# Altium schematic sheet ch347f.SchDoc
size A4; SheetNumber: 1; SheetTotal: 5
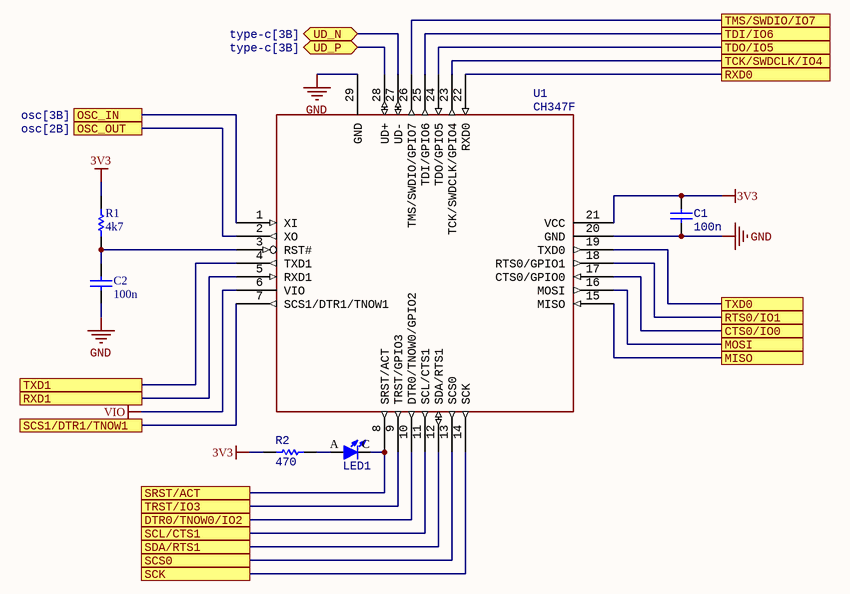
[diagram p0: ch347f.SchDoc]

## Parts
C1  value 100n  [CAPC100X50X55L25N]  (hidden comment: Capacitor)
C2  value 100n  [CAPC100X50X55L25N]  (hidden comment: Capacitor)
LED1  蓝灯 正贴  [LEDC100X50X45L25N]  (value not drawn)
R1  value 4k7  [RESC100X50X35L25N]  (hidden comment: Resistor)
R2  value 470  [RESC100X50X35L25N]  (hidden comment: Resistor)
U1  CH347F  [QFN28_4X4]

## Ports
CTS0/IO0, DTR0/TNOW0/IO2, MISO, MOSI, OSC_IN (see osc[3B]), OSC_OUT (see osc[2B]), RTS0/IO1, RXD0, RXD1, SCK, SCL/CTS1, SCS0, SCS1/DTR1/TNOW1, SDA/RTS1, SRST/ACT, TCK/SWDCLK/IO4, TDI/IO6, TDO/IO5, TMS/SWDIO/IO7, TRST/IO3, TXD0, TXD1, UD_N (bidir, see type-c[3B]), UD_P (bidir, see type-c[3B])

## Nets
3V3: C1.2 R1.1 R2.1 U1.21(VCC)
GND: C1.1 C2.1 U1.20(GND) U1.29(GND)
VIO: U1.6(VIO)
CTS0/IO0: U1.17(CTS0/GPIO0) ; port CTS0/IO0
DTR0/TNOW0/IO2: U1.10(DTR0/TNOW0/GPIO2) ; port DTR0/TNOW0/IO2
MISO: U1.15(MISO) ; port MISO
MOSI: U1.16(MOSI) ; port MOSI
OSC_IN: U1.1(XI) ; port OSC_IN
OSC_OUT: U1.2(XO) ; port OSC_OUT
RTS0/IO1: U1.18(RTS0/GPIO1) ; port RTS0/IO1
RXD0: U1.22(RXD0) ; port RXD0
RXD1: U1.5(RXD1) ; port RXD1
SCK: U1.14(SCK) ; port SCK
SCL/CTS1: U1.11(SCL/CTS1) ; port SCL/CTS1
SCS0: U1.13(SCS0) ; port SCS0
SCS1/DTR1/TNOW1: U1.7(SCS1/DTR1/TNOW1) ; port SCS1/DTR1/TNOW1
SDA/RTS1: U1.12(SDA/RTS1) ; port SDA/RTS1
SRST/ACT: LED1.C(K) U1.8(SRST/ACT) ; port SRST/ACT
TCK/SWDCLK/IO4: U1.23(TCK/SWDCLK/GPIO4) ; port TCK/SWDCLK/IO4
TDI/IO6: U1.25(TDI/GPIO6) ; port TDI/IO6
TDO/IO5: U1.24(TDO/GPIO5) ; port TDO/IO5
TMS/SWDIO/IO7: U1.26(TMS/SWDIO/GPIO7) ; port TMS/SWDIO/IO7
TRST/IO3: U1.9(TRST/GPIO3) ; port TRST/IO3
TXD0: U1.19(TXD0) ; port TXD0
TXD1: U1.4(TXD1) ; port TXD1
UD_N: U1.27(UD-) ; port UD_N
UD_P: U1.28(UD+) ; port UD_P
NetC2_2: C2.2 R1.2 U1.3(RST#)
NetLED1_A: LED1.A R2.2

## Library data of the parts
C1 C2 = GRM188R61E106KA73D: MPN: TCC0402X5R104M250AT; Manufacturer: CCTC(三环); 编号: C359190; Case/Package: 0402; Mounting Type: SMD
LED1 = LED-SMD: 贴片LED; 编号: C965795
R1 = RC0402FR-07100KL: MPN: RTT02472JTH; Manufacturer: RALEC(旺诠); 编号: C103059; Case/Package: 0402; Mounting Type: SMD
R2 = RC0402FR-07100KL: MPN: RTT02471JTH; Manufacturer: RALEC(旺诠); 编号: C103058; Case/Package: 0402; Mounting Type: SMD
U1 = CH347F: High Speed USB to UART + SPI + IIC + JTAG